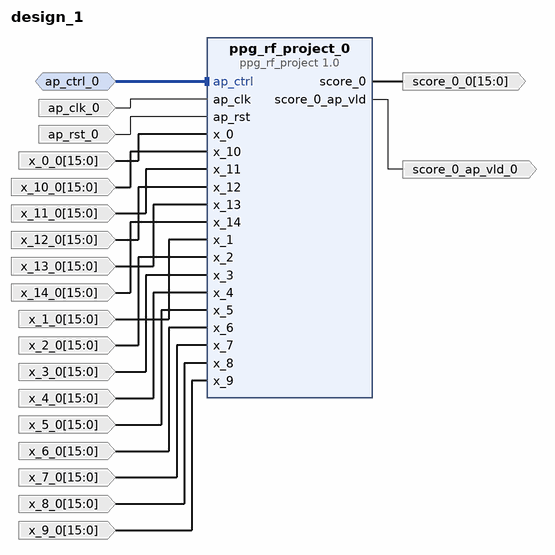
[diagram p0: block diagram of the top level]
# Vivado block design design_1, xc7a100tcsg324-1, Vivado 2024.1
create_bd_design design_1

create_bd_intf_port -mode Slave -vlnv xilinx.com:interface:acc_handshake_rtl:1.0 ap_ctrl_0
create_bd_port -dir I -type clk ap_clk_0
create_bd_port -dir I -type rst ap_rst_0
set_property -dict {CONFIG.POLARITY ACTIVE_HIGH} [get_bd_ports ap_rst_0]
create_bd_port -dir O -from 15 -to 0 -type data score_0_0
create_bd_port -dir O score_0_ap_vld_0
create_bd_port -dir I -from 15 -to 0 -type data x_0_0
create_bd_port -dir I -from 15 -to 0 -type data x_1_0
create_bd_port -dir I -from 15 -to 0 -type data x_10_0
create_bd_port -dir I -from 15 -to 0 -type data x_11_0
create_bd_port -dir I -from 15 -to 0 -type data x_12_0
create_bd_port -dir I -from 15 -to 0 -type data x_13_0
create_bd_port -dir I -from 15 -to 0 -type data x_14_0
create_bd_port -dir I -from 15 -to 0 -type data x_2_0
create_bd_port -dir I -from 15 -to 0 -type data x_3_0
create_bd_port -dir I -from 15 -to 0 -type data x_4_0
create_bd_port -dir I -from 15 -to 0 -type data x_5_0
create_bd_port -dir I -from 15 -to 0 -type data x_6_0
create_bd_port -dir I -from 15 -to 0 -type data x_7_0
create_bd_port -dir I -from 15 -to 0 -type data x_8_0
create_bd_port -dir I -from 15 -to 0 -type data x_9_0

create_bd_cell -type ip -vlnv xilinx.com:hls:ppg_rf_project:1.0 ppg_rf_project_0

# ---- connections ----

connect_bd_intf_net -intf_net ap_ctrl_0_1 [get_bd_intf_ports ap_ctrl_0] [get_bd_intf_pins ppg_rf_project_0/ap_ctrl]
connect_bd_net -net ap_clk_0_1 [get_bd_ports ap_clk_0] [get_bd_pins ppg_rf_project_0/ap_clk]
connect_bd_net -net ap_rst_0_1 [get_bd_ports ap_rst_0] [get_bd_pins ppg_rf_project_0/ap_rst]
connect_bd_net [get_bd_pins ppg_rf_project_0/score_0] [get_bd_ports score_0_0]
connect_bd_net [get_bd_pins ppg_rf_project_0/score_0_ap_vld] [get_bd_ports score_0_ap_vld_0]
connect_bd_net -net x_0_0_1 [get_bd_ports x_0_0] [get_bd_pins ppg_rf_project_0/x_0]
connect_bd_net -net x_10_0_1 [get_bd_ports x_10_0] [get_bd_pins ppg_rf_project_0/x_10]
connect_bd_net -net x_11_0_1 [get_bd_ports x_11_0] [get_bd_pins ppg_rf_project_0/x_11]
connect_bd_net -net x_12_0_1 [get_bd_ports x_12_0] [get_bd_pins ppg_rf_project_0/x_12]
connect_bd_net -net x_13_0_1 [get_bd_ports x_13_0] [get_bd_pins ppg_rf_project_0/x_13]
connect_bd_net -net x_14_0_1 [get_bd_ports x_14_0] [get_bd_pins ppg_rf_project_0/x_14]
connect_bd_net -net x_1_0_1 [get_bd_ports x_1_0] [get_bd_pins ppg_rf_project_0/x_1]
connect_bd_net -net x_2_0_1 [get_bd_ports x_2_0] [get_bd_pins ppg_rf_project_0/x_2]
connect_bd_net -net x_3_0_1 [get_bd_ports x_3_0] [get_bd_pins ppg_rf_project_0/x_3]
connect_bd_net -net x_4_0_1 [get_bd_ports x_4_0] [get_bd_pins ppg_rf_project_0/x_4]
connect_bd_net -net x_5_0_1 [get_bd_ports x_5_0] [get_bd_pins ppg_rf_project_0/x_5]
connect_bd_net -net x_6_0_1 [get_bd_ports x_6_0] [get_bd_pins ppg_rf_project_0/x_6]
connect_bd_net -net x_7_0_1 [get_bd_ports x_7_0] [get_bd_pins ppg_rf_project_0/x_7]
connect_bd_net -net x_8_0_1 [get_bd_ports x_8_0] [get_bd_pins ppg_rf_project_0/x_8]
connect_bd_net -net x_9_0_1 [get_bd_ports x_9_0] [get_bd_pins ppg_rf_project_0/x_9]

validate_bd_design
save_bd_design
